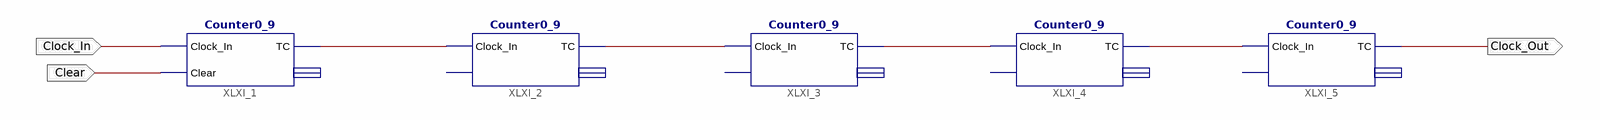
[diagram p0: schematic sheet 1]
// Xilinx ISE schematic Div100k.sch (spartan6) as structural Verilog: 5 symbols, 3 ports
module Div100k (
  input  Clock_In,
  input  Clear,
  output Clock_Out
);

  wire XLXN_1, XLXN_2, XLXN_3, XLXN_4;

  Counter0_9 XLXI_1 (.Clock_In(Clock_In), .Clear(Clear), .TC(XLXN_1));  // open: Count
  Counter0_9 XLXI_2 (.Clock_In(XLXN_1), .TC(XLXN_2));  // open: Clear, Count
  Counter0_9 XLXI_3 (.Clock_In(XLXN_2), .TC(XLXN_3));  // open: Clear, Count
  Counter0_9 XLXI_4 (.Clock_In(XLXN_3), .TC(XLXN_4));  // open: Clear, Count
  Counter0_9 XLXI_5 (.Clock_In(XLXN_4), .TC(Clock_Out));  // open: Clear, Count
endmodule
